# Altium schematic sheet magnetorquer_shield.SchDoc
size 381 x 241 mm
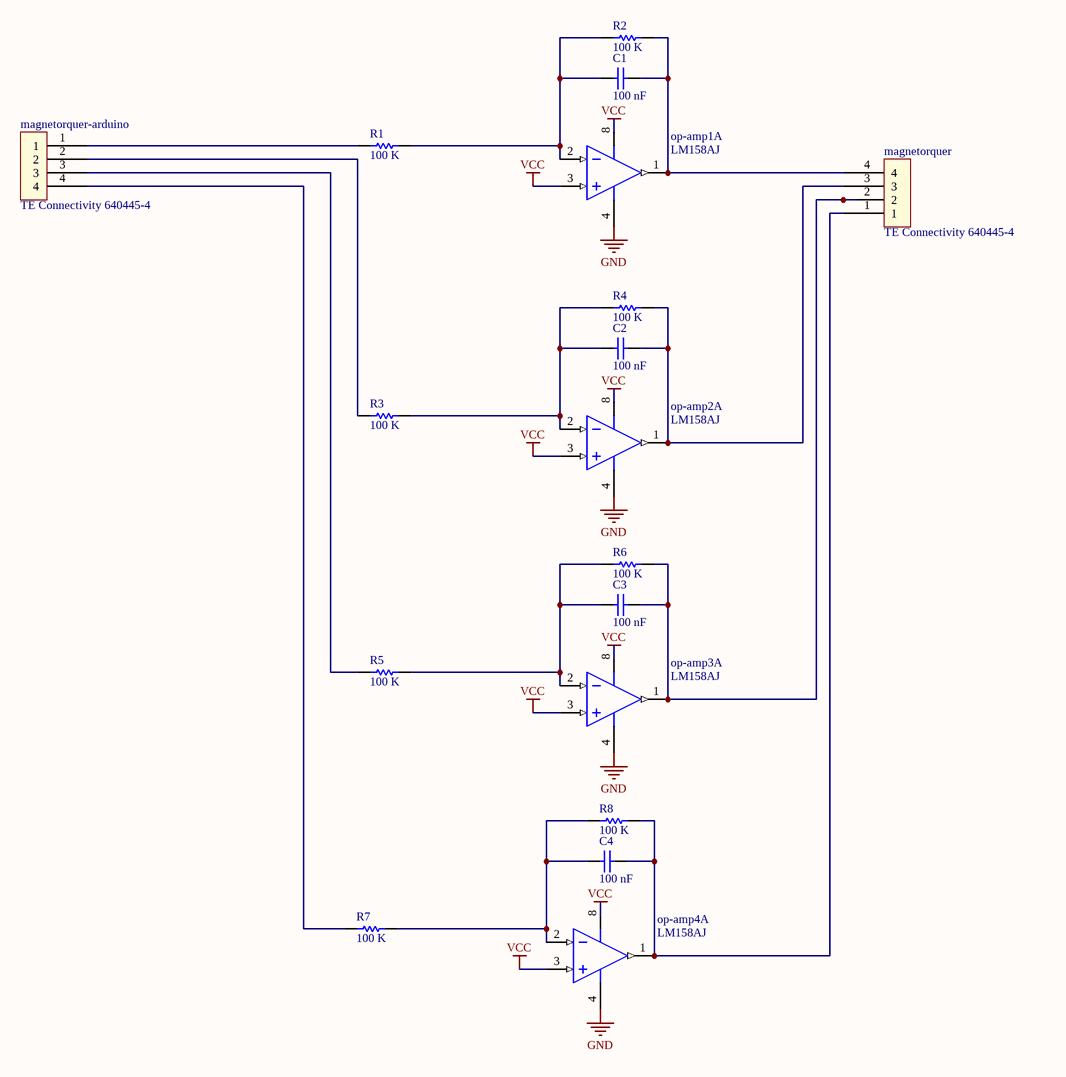
[diagram p0: magnetorquer_shield.SchDoc]

## Parts
C1  100 nF  [PCB-19299713-1]
C2  100 nF  [PCB-19299713-1]
C3  100 nF  [PCB-19299713-1]
C4  100 nF  [PCB-19299713-1]
magnetorquer  TE Connectivity 640445-4  [PCB-ri65nbe9iynob6pe1jn9-1]
magnetorquer-arduino  TE Connectivity 640445-4  [PCB-ri65nbe9iynob6pe1jn9-1]
op-amp1  LM158AJ  [J08A]  (part A of 2)
op-amp2  LM158AJ  [J08A]  (part A of 2)
op-amp3  LM158AJ  [J08A]  (part A of 2)
op-amp4  LM158AJ  [J08A]  (part A of 2)
R1  100 K  [RESC2013X50X30ML20T20]
R2  100 K  [RESC2013X50X30ML20T20]
R3  100 K  [RESC2013X50X30ML20T20]
R4  100 K  [RESC2013X50X30ML20T20]
R5  100 K  [RESC2013X50X30ML20T20]
R6  100 K  [RESC2013X50X30ML20T20]
R7  100 K  [RESC2013X50X30ML20T20]
R8  100 K  [RESC2013X50X30ML20T20]

## Nets
GND: op-amp1.4(GND) op-amp2.4(GND) op-amp3.4(GND) op-amp4.4(GND)
VCC: op-amp1.3(INA+) op-amp1.8(V+) op-amp2.3(INA+) op-amp2.8(V+) op-amp3.3(INA+) op-amp3.8(V+) op-amp4.3(INA+) op-amp4.8(V+)
NetC1_1: C1.1 op-amp1.2(INA-) R1.2 R2.1
NetC1_2: C1.2 magnetorquer.4 op-amp1.1(OUTA) R2.2
NetC2_1: C2.1 op-amp2.2(INA-) R3.2 R4.1
NetC2_2: C2.2 magnetorquer.3 op-amp2.1(OUTA) R4.2
NetC3_1: C3.1 op-amp3.2(INA-) R5.2 R6.1
NetC3_2: C3.2 magnetorquer.2 op-amp3.1(OUTA) R6.2
NetC4_1: C4.1 op-amp4.2(INA-) R7.2 R8.1
NetC4_2: C4.2 magnetorquer.1 op-amp4.1(OUTA) R8.2
Netmagnetorquer-arduino_1: magnetorquer-arduino.1 R1.1
Netmagnetorquer-arduino_2: magnetorquer-arduino.2 R3.1
Netmagnetorquer-arduino_3: magnetorquer-arduino.3 R5.1
Netmagnetorquer-arduino_4: magnetorquer-arduino.4 R7.1

## Library data of the parts
C1-C4 = CMP-19299713-2: CAP CER 0.1UF 16V 10% X7R 0603; Capacitance: 1e-07 F; Case/Package (SI): 1608; Lead-Free Status: Lead Free; Voltage Rating (DC): 16.0 V; Capacitance Tolerance: ±10%; Dielectric Characteristic: X7R; Lifecycle Status: Active; Mounting Style: Surface Mount; Number of Pins: 2; Octopart Url: https://octopart.com/grm188r71c104ka01d-murata-196247; OctopartID: d5b81cb00e490a7f; Packaging: Cut Tape (CT); REACH SVHC Compliance: No SVHC; RoHS: Compliant; Size-Height: 0.0008 m; Size-Length: 0.0016 m; Size-Thickness: 0.0008 m; Size-Width: 0.0008 m
magnetorquer magnetorquer-arduino = CMP-b6d87d170e53691f-2: MTA-156 4 Position 3.96 mm Single Row Through-Hole Straight Wire to Board Header; ELV Compliant: Compliant; Pin Pitch: 0.0039624 m; Voltage Rating (AC): 600.0 V; Mounting Angle: 180.0 °; Lead-Free Status: Lead Free; Gender: Male; Number of Contacts: 4; Current Rating: 7.0 A; Shrouded: No; Contact Plating: Tin; REACH SVHC Compliance: No SVHC; Manufacturer Part Number: 640445-4; Size-Length: 0.01585 m; Octopart URL: http://octopart.com/640445-4-te+connectivity-46505453; Housing Material: Polyester; Orientation: Vertical; RoHS: Compliant; Size-Width: 0.007747 m; Number of Rows: 1; Flammability Rating: UL 94 V-0; OctopartID: b6d87d170e53691f; Lifecycle Status: Active; Contact Material: Copper Alloy; Housing Color: Natural; Packaging: Bag; Number of Positions: 4; Size-Height: 0.010795 m; Mounting Style: Through Hole, Vertical
op-amp1-op-amp4 = LM158AJ: Low Power Dual Operational Amplifier, 8-pin CerDIP; Number of Channels: 2; Output Current: 0.02 A; Lifecycle Status: Active; Number of Pins: 8; Octopart Url: https://octopart.com/lm158aj-texas+instruments-64865023; OctopartID: 2c18e6cfcb81f3df; Packaging: Rail
R1-R8 = CMP-1857726-3: Res Thick Film 0805 100K Ohm 1% 1/8W ±100ppm/C Molded SMD Paper T/R; Lead-Free Status: Lead Free; Power Rating: 0.125 W; Case/Package (SI): 2012; Voltage Rating (DC): 150.0 V; Temperature Coefficient: 100.0 ppm/°C; Resistance: 100000.0 Ω; Mounting Style: Surface Mount; Number of Pins: 2; Case/Package: 0805; Resistance Tolerance: ±1%; OctopartID: 6231a9614adabdf6; Octopart Url: https://octopart.com/crcw0805100kfkea-vishay-39456141; REACH SVHC Compliance: No SVHC; RoHS: Compliant; Size-Width: 0.00125 m; Size-Length: 0.002 m; Size-Height: 0.00045 m